# EAGLE design prop_breakout (EAGLE 7.5.0)
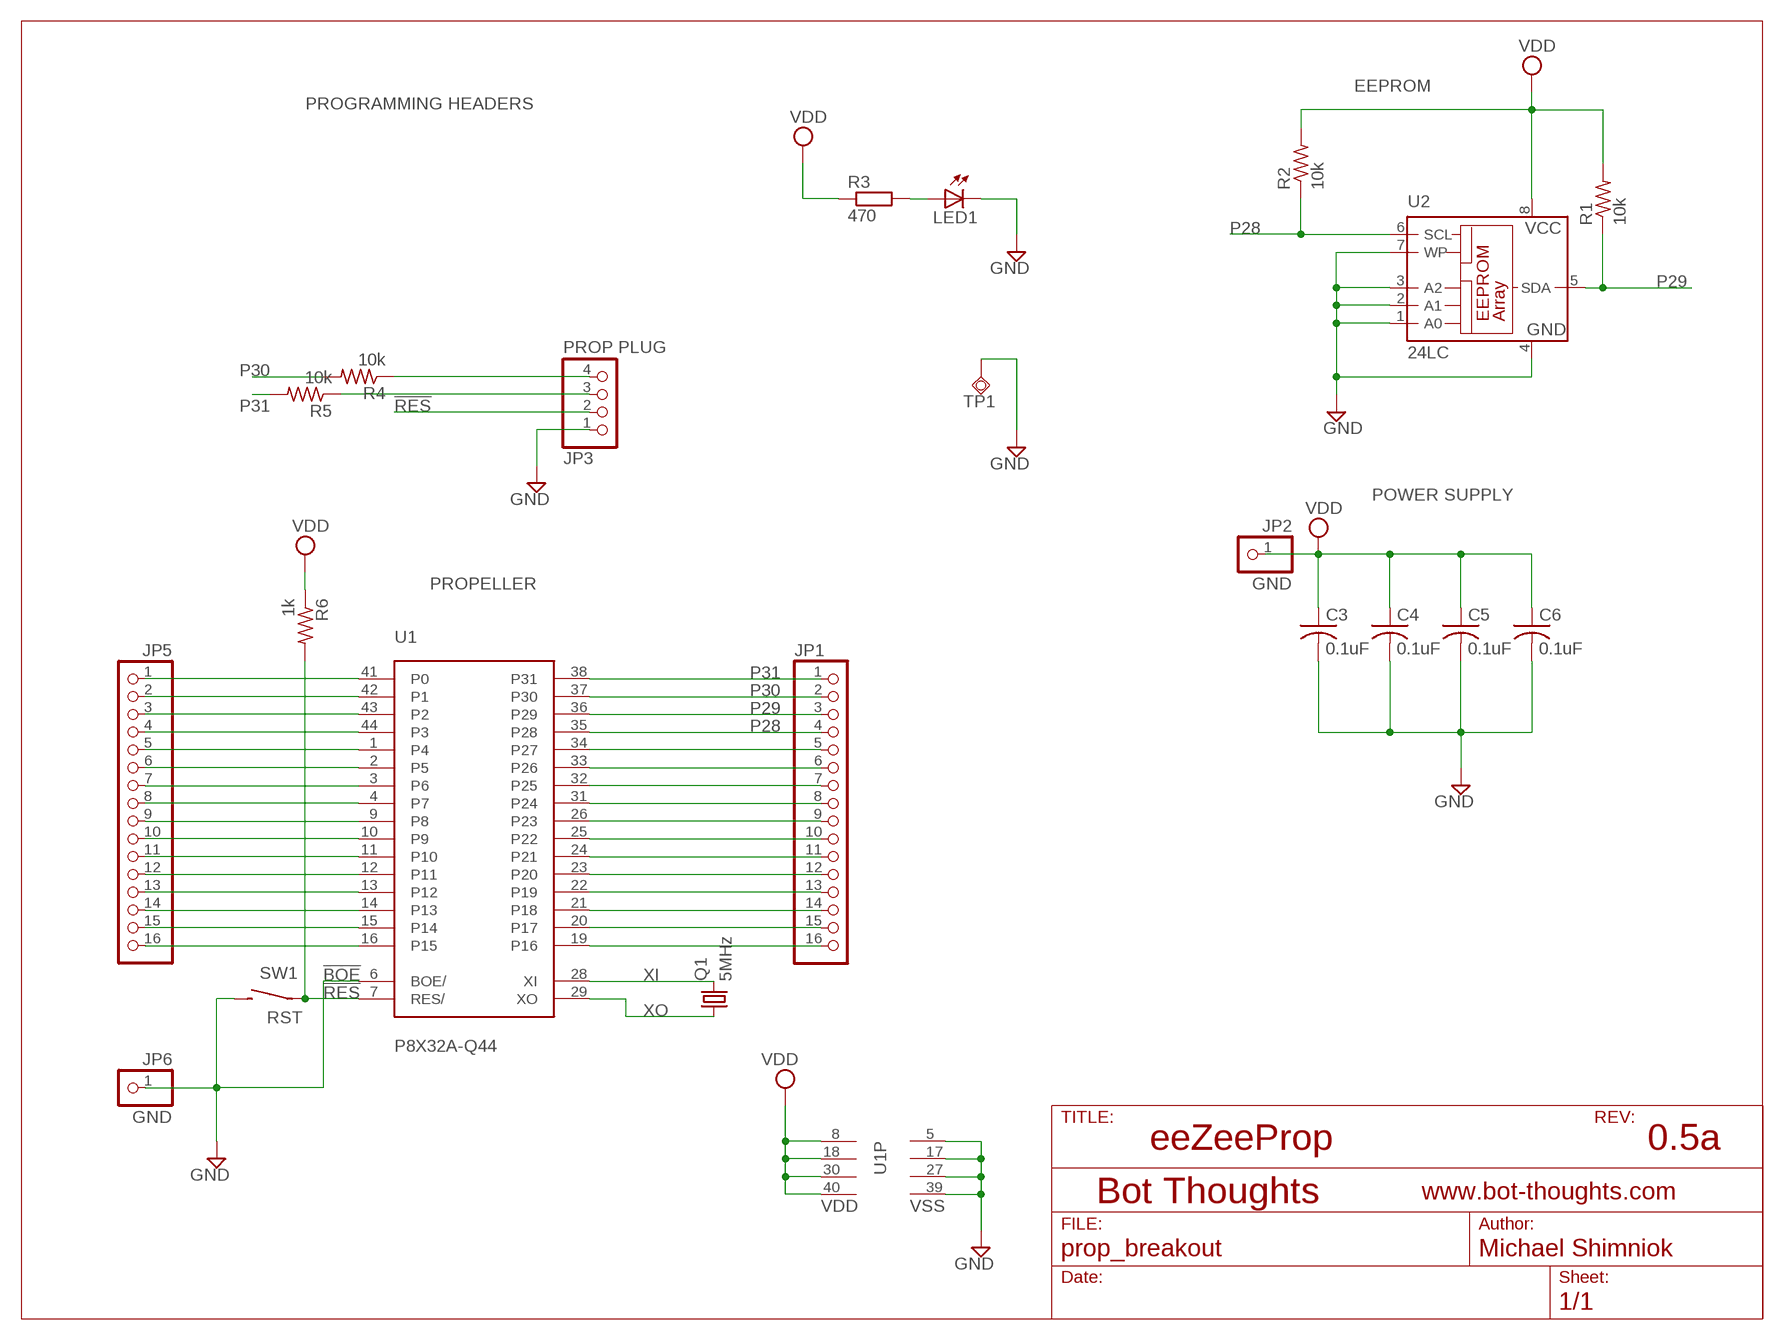
[diagram p0: schematic, sheet 1]

## Parts
C3  0.1uF  C-USC0805  [C0805]
C4  0.1uF  C-USC0805  [C0805]
C5  0.1uF  C-USC0805  [C0805]
C6  0.1uF  C-USC0805  [C0805]
JP1  PINHD-1X16_2.54-S  [1X16-S]
JP2  GND  PINHD-1X01_2.54  [1X01]
JP3  PROP PLUG  PINHD-1X04_2.54-S  [1X04-S]
JP5  PINHD-1X16_2.54-S  [1X16-S]
JP6  GND  PINHD-1X01_2.54  [1X01]
LED1  0  LEDCHIPLED_1206  [CHIPLED_1206]
Q1  5MHz  CRYSTALHC49U-V  [HC49U-V]
R1  10k  R-US_R0805  [R0805]
R2  10k  R-US_R0805  [R0805]
R3  470  R-EU_R0805  [R0805]
R4  10k  R-US_R0805  [R0805]
R5  10k  R-US_R0805  [R0805]
R6  1k  R-US_R0805  [R0805]
SW1  RST  SPST_TAC_RECT1  [6MMTACTILE_RECT]
TP1  TPSQTP20R  [TP20R]
U1  P8X32A-Q44  [P8X32A-Q44]
U2  24LC  24LC128SN  [SO-08]

## Nets
!RES: JP3.2 R6.2 SW1.P$1(P) U1.7(RES/)
GND [GND]: C3.2 C4.2 C5.2 C6.2 JP3.1 JP6.1 LED1.C SW1.P$2(S) TP1.TP U1.5(VSS) U1.6(BOE/) U1.17(VSS) U1.27(VSS) U1.39(VSS) U2.1(A0) U2.2(A1) U2.3(A2) U2.4(GND) U2.7(WP)
N$1: JP5.1 U1.41(P0)
N$2: JP5.2 U1.42(P1)
N$3: JP5.3 U1.43(P2)
N$4: JP5.4 U1.44(P3)
N$5: LED1.A R3.2
N$6: JP5.5 U1.1(P4)
N$8: JP5.6 U1.2(P5)
N$9: JP5.7 U1.3(P6)
N$10: JP5.8 U1.4(P7)
N$11: JP5.9 U1.9(P8)
N$12: JP5.10 U1.10(P9)
N$13: JP5.11 U1.11(P10)
N$14: JP5.12 U1.12(P11)
N$15: JP5.13 U1.13(P12)
N$16: JP5.14 U1.14(P13)
N$17: JP5.15 U1.15(P14)
N$18: JP5.16 U1.16(P15)
N$19: JP1.5 U1.34(P27)
N$20: JP1.6 U1.33(P26)
N$21: JP1.7 U1.32(P25)
N$22: JP1.8 U1.31(P24)
N$23: JP1.9 U1.26(P23)
N$24: JP1.10 U1.25(P22)
N$25: JP1.11 U1.24(P21)
N$26: JP1.12 U1.23(P20)
N$27: JP1.13 U1.22(P19)
N$28: JP1.14 U1.21(P18)
N$29: JP1.15 U1.20(P17)
N$30: JP1.16 U1.19(P16)
P28: JP1.4 R2.1 U1.35(P28) U2.6(SCL)
P29: JP1.3 R1.1 U1.36(P29) U2.5(SDA)
P30: JP1.2 R4.2 U1.37(P30)
P31: JP1.1 R5.2 U1.38(P31)
RXI: JP3.4 R4.1
TXO: JP3.3 R5.1
VDD [VCC]: C3.1 C4.1 C5.1 C6.1 JP2.1 R1.2 R2.2 R3.1 R6.1 U1.8(VDD) U1.18(VDD) U1.30(VDD) U1.40(VDD) U2.8(VCC)
XI: Q1.2 U1.28(XI)
XO: Q1.1 U1.29(XO)

## Notes on the sheet
- EEPROM
- PROGRAMMING HEADERS
- POWER SUPPLY
- PROPELLER
- !BOE
- eeZeeProp | 0.5a

## Library data of the parts
C3-C6 = rcl:C-US: CAPACITOR, American symbol; PARTNO: 0603YC104KAT2A; SIZE: (0603); TC: X5R; TOL: 20%; TYPE: CER; VOLT: 10V
JP1 JP5 = pinhead-2:PINHD-1X16: PIN HEADER
JP2 JP6 = pinhead-2:PINHD-1X01: PIN HEADER
JP3 = pinhead-2:PINHD-1X04: PIN HEADER
LED1 = led:LED: LED OSRAM: - CHIPLED LG R971, LG N971, LY N971, LG Q971, LY Q971, LO R971, LY R971 LH N974, LH R974 LS Q976, LO Q976, LY Q976 LO Q996 - Hyper CHIPLED LW Q18S LB Q993, LB Q99A, LB R99A - SideLED LS A670, LO A670, LY A670, LG A670, LP A670 LB A673, LV A673, LT A673, LW A673 LH A674 LY A675 LS A676, LA A676, LO A676, LY A676, LW A676 LS A679, LY A679, LG A679 - Hyper Micro SIDELED® LS Y876, LA Y876, LO Y876, LY Y876 LT Y87S - SmartLED LW L88C, LW L88S LB L89C, LB L89S, LG L890 LS L89K, LO L89K, LY L89K LS L896, LA L896, LO L896, LY L896 - TOPLED LS T670, LO T670, LY T670, LG T670, LP T670 LSG T670, LSP T670, LSY T670, LOP T670, LYG T670 LG T671, LOG T671, LSG T671 LB T673, LV T673, LT T673, LW T673 LH T674 LS T676, LA T676, LO T676, LY T676, LB T676, LH T676, LSB T676, LW T676 LB T67C, LV T67C, LT T67C, LS T67K, LO T67K, LY T67K, LW E67C LS E67B, LA E67B, LO E67B, LY E67B, LB E67C, LV E67C, LT E67C LW T67C LS T679, LY T679, LG T679 LS T770, LO T770, LY T770, LG T770, LP T770 LB T773, LV T773, LT T773, LW T773 LH T774 LS E675, LA E675, LY E675, LS T675 LS T776, LA T776, LO T776, LY T776, LB T776 LHGB T686 LT T68C, LB T68C - Hyper Mini TOPLED® LB M676 - Mini TOPLED Santana® LG M470 LS M47K, LO M47K, LY M47K Source: http://www.osram.convergy.de LUXEON: - LUMILED® LXK2-PW12-R00, LXK2-PW12-S00, LXK2-PW14-U00, LXK2-PW14-V00 LXK2-PM12-R00, LXK2-PM12-S00, LXK2-PM14-U00 LXK2-PE12-Q00, LXK2-PE12-R00, LXK2-PE12-S00, LXK2-PE14-T00, LXK2-PE14-U00 LXK2-PB12-K00, LXK2-PB12-L00, LXK2-PB12-M00, LXK2-PB14-N00, LXK2-PB14-P00, LXK2-PB14-Q00 LXK2-PR12-L00, LXK2-PR12-M00, LXK2-PR14-Q00, LXK2-PR14-R00 LXK2-PD12-Q00, LXK2-PD12-R00, LXK2-PD12-S00 LXK2-PH12-R00, LXK2-PH12-S00 LXK2-PL12-P00, LXK2-PL12-Q00, LXK2-PL12-R00 Source: www.luxeon.com KINGBRIGHT: KA-3528ASYC Source: www.kingbright.com
Q1 = crystal:CRYSTAL: CRYSTAL; OC_FARNELL: 1666969; OC_NEWARK: unknown; PARTNO: HC49US-5.000MABJ-UB
R1 R2 = rcl:R-US_: RESISTOR, American symbol; PARTNO: ERJ-3GEYJ103V; RATE: 100mW; SIZE: (0603); TOL: 5%
R3 = resistor:R-EU_: RESISTOR, European symbol
R4-R6 = rcl:R-US_: RESISTOR, American symbol; PARTNO: RC0603JR-071KL; RATE: 100mW; SIZE: (0603); TOL: 5%
SW1 = mes_electromech:SPST: SPST SWITCH; PARTNO: MJTP1243
TP1 = testpad:TPSQ: Test pad
U1 = parallax_propeller:P8X32A-Q44; PARTNO: P8X32A-Q44
U2 = microchip:24*: Serial EEPROM I2C; MF: OnSemi; MPN: CAT24C256WI-GT3; OC_FARNELL: 9757937; OC_NEWARK: 30H1511; PARTNO: CAT24C256WI-GT3

## Net classes
0 default: width 0.203 mm
1 VCC: width 0.508 mm, drill 0.508 mm
2 GND: width 0.508 mm, drill 0.508 mm

## Board
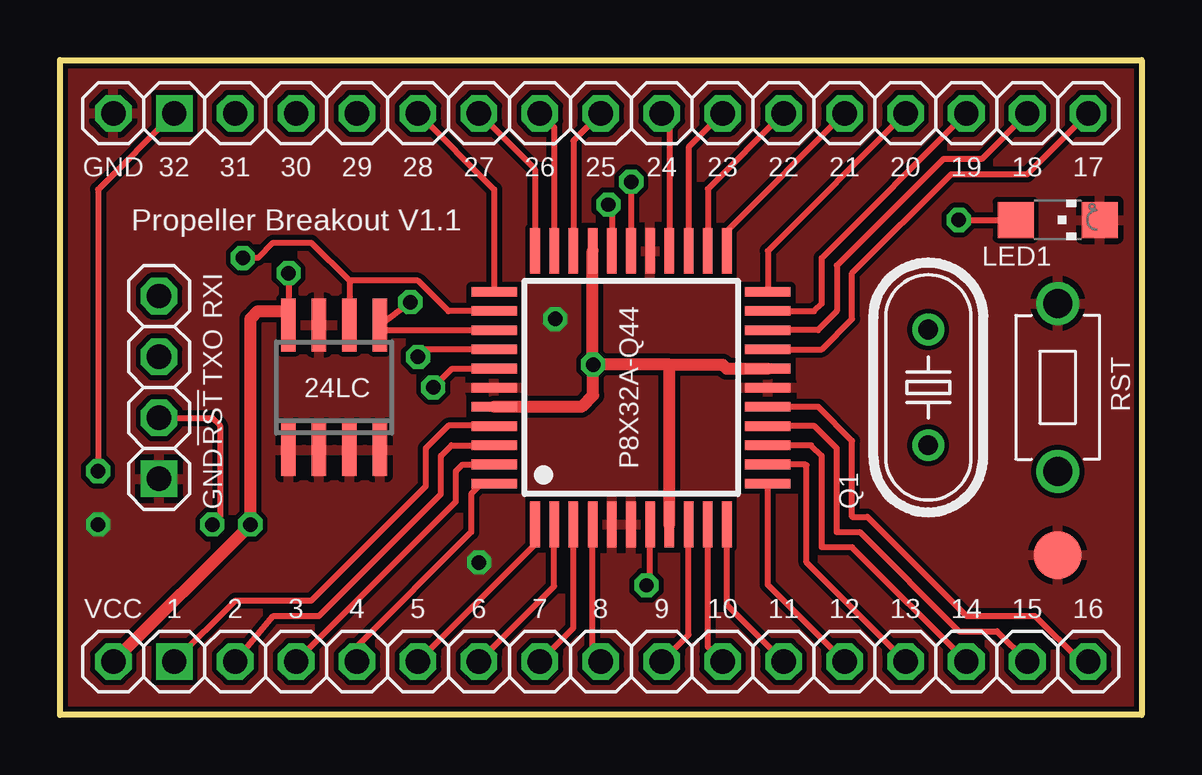
[diagram p1: board, top side]
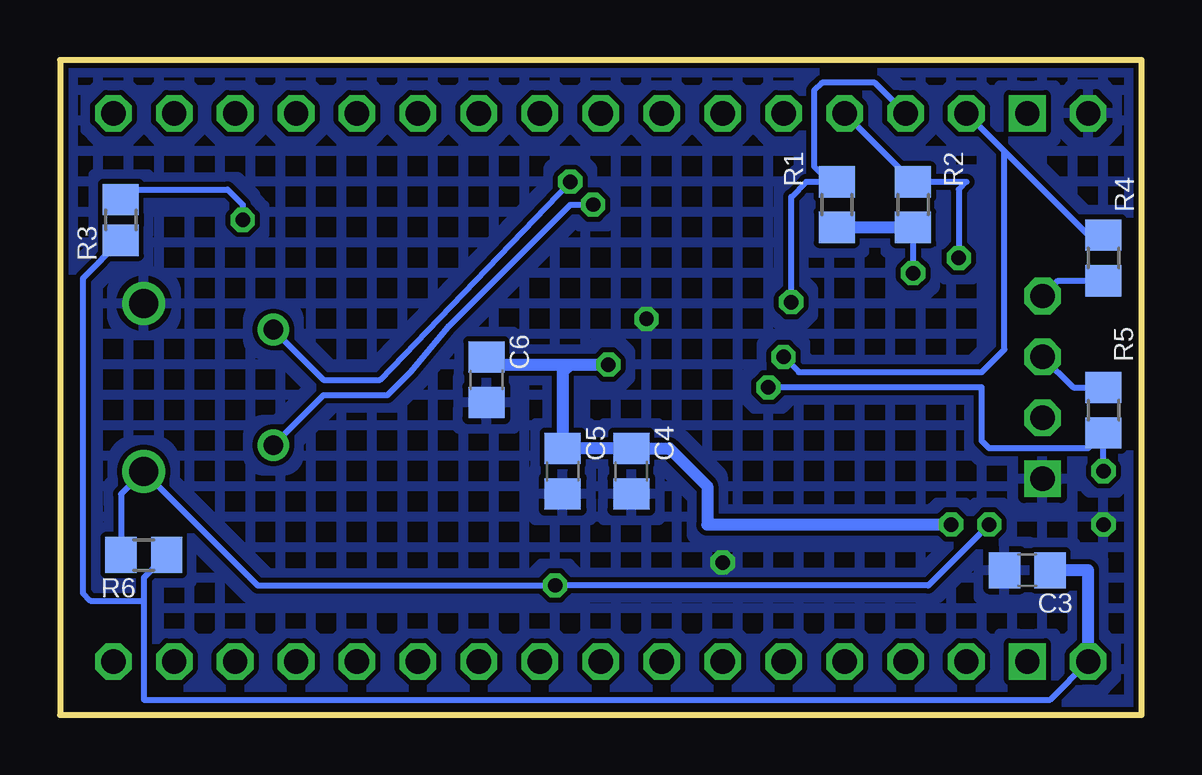
[diagram p2: board, bottom side, seen from below]

Size 45.09 x 27.3 mm. Coordinates in mm from the lower left corner, seen from the top.
Outline: 0,0 0,27.3 45.09,27.3 45.09,0 0,0
Copper layers (1*16): Top 0.035mm / dielectric 1.5mm / Bottom 0.035mm
Design rules "default *": minimum track width 10mil, minimum drill 20mil, track to track 8mil, track to pad 8mil, pad to pad 8mil, via to via 8mil, smd to smd 8mil, copper to edge 8mil, drill to drill 8mil, minimum pad ring 10mil, minimum via ring 8mil, stop-mask expansion 4mil, vias tented up to drill 0mil, thermal gap 10mil

### Footprints (pad centres in the part's own frame; a part is rotated, then mirrored left to right if it is on the bottom)
C0805 = smd 1.3 x 1.5: 1 -0.95,0; 2 0.95,0
1X16-S = drill 1.016 square: 1 -19.05,0 | drill 1.016 octagon: 2 -16.51,0; 3 -13.97,0; 4 -11.43,0; 5 -8.89,0; 6 -6.35,0; 7 -3.81,0; 8 -1.27,0; 9 1.27,0; 10 3.81,0; 11 6.35,0; 12 8.89,0; 13 11.43,0; 14 13.97,0; 15 16.51,0; 16 19.05,0
1X01 = drill 1.016 octagon: 1 0,0
1X04-S = drill 1.016 square: 1 -3.81,0 | drill 1.016 octagon: 2 -1.27,0; 3 1.27,0; 4 3.81,0
CHIPLED_1206 = smd 1.5 x 1.5: A 0,-1.75; C 0,1.75
HC49U-V = drill 0.813: 1 -2.413,0; 2 2.413,0
R0805 = smd 1.3 x 1.5: 1 -0.95,0; 2 0.95,0
R0805' = smd 1.3 x 1.5: 1 -0.85,0; 2 0.85,0
6MMTACTILE_RECT = drill 1.2: P$1 -3.5,0; P$2 3.5,0
TP20R = smd 2 x 2: TP 0,0
P8X32A-Q44 = smd 1.9 x 0.4: 1 -5.713,4.013; 2 -5.713,3.212; 3 -5.713,2.413; 4 -5.713,1.613; 5 -5.713,0.812; 6 -5.713,0.013; 7 -5.713,-0.787; 8 -5.713,-1.587; 9 -5.713,-2.388; 10 -5.713,-3.188; 11 -5.713,-3.987; 23 5.688,-3.987; 24 5.688,-3.188; 25 5.688,-2.388; 26 5.688,-1.587; 27 5.688,-0.787; 28 5.688,0.013; 29 5.688,0.812; 30 5.688,1.613; 31 5.688,2.413; 32 5.688,3.212; 33 5.688,4.013 | smd 0.4 x 1.9: 12 -4.013,-5.688; 13 -3.212,-5.688; 14 -2.413,-5.688; 15 -1.613,-5.688; 16 -0.812,-5.688; 17 -0.013,-5.688; 18 0.787,-5.688; 19 1.587,-5.688; 20 2.388,-5.688; 21 3.188,-5.688; 22 3.987,-5.688; 34 3.987,5.713; 35 3.188,5.713; 36 2.388,5.713; 37 1.587,5.713; 38 0.787,5.713; 39 -0.013,5.713; 40 -0.812,5.713; 41 -1.613,5.713; 42 -2.413,5.713; 43 -3.212,5.713; 44 -4.013,5.713
SO-08 = smd 0.6 x 2.2: 1 -1.905,-2.6; 2 -0.635,-2.6; 3 0.635,-2.6; 4 1.905,-2.6; 5 1.905,2.6; 6 0.635,2.6; 7 -0.635,2.6; 8 -1.905,2.6

### Placement (x,y rotation side)
C3  4.76,6.03 180 bottom
C4  21.27,10.16 270 bottom
C5  24.13,10.16 270 bottom
C6  27.31,13.97 270 bottom
JP1  23.81,25.08 0 top
JP2  2.22,2.22 0 top
JP3  4.13,13.65 90 top
JP5  23.81,2.22 0 top
JP6  2.22,25.08 0 top
LED1  41.59,20.64 270 top
Q1  36.2,13.65 90 top
R1  12.7,21.27 270 bottom
R2  9.53,21.27 270 bottom
R3  470  [R0805']  42.55,20.64 90 bottom
R4  1.59,19.05 90 bottom
R5  1.59,12.7 270 bottom
R6  41.59,6.67 180 bottom
SW1  41.59,13.65 90 top
TP1  41.59,6.67 0 top
U1  23.81,13.65 90 top
U2  11.43,13.65 0 top

### Tracks (layer width: path | path; a pad name or v marks a point on that pad's centre or on a via)
!RES  (via drill 0.6)
  Top 0.254: v24.45,5.4 24.6,5.55 U1.7 | JP3.2 6.35,12.38 6.67,12.06 6.67,8.25 v6.35,7.94
  Bottom 0.254: R6.2 42.54,9.2 SW1.P$1 36.84,5.4 v24.45,5.4 8.89,5.4 v6.35,7.94
GND  (via drill 0.6)
  other vias: 17.46,6.35 20.64,16.51 1.59,7.94
  pour Bottom (hatched): -0.95,28.26 46.36,28.26 46.36,-1.27 -0.95,-1.27
  pour Top: -0.95,28.26 46.36,28.26 46.36,-1.27 -0.95,-1.27
N$1
  Top 0.254: U1.41 18.07,12.06 16.19,12.06 15.24,11.11 15.24,9.52 10.48,4.76 7.3,4.76 JP5.1
N$2
  Top 0.254: JP5.2 8.89,4.13 10.79,4.13 15.87,9.21 15.87,10.8 16.32,11.24 U1.42
N$3
  Top 0.254: JP5.3 16.51,8.89 16.51,10.16 16.79,10.44 U1.43
N$4
  Top 0.254: JP5.4 12.38,2.86 17.14,7.62 17.14,9.21 17.58,9.64 U1.44
N$5  (via drill 0.6)
  Top 0.254: v37.47,20.64 LED1.A
  Bottom 0.254: R3.2 42.12,21.91 38.1,21.91 37.47,21.27 v37.47,20.64
N$6
  Top 0.254: JP5.5 19.8,7.1 U1.1
N$8
  Top 0.254: JP5.6 20.6,5.36 U1.2
N$9
  Top 0.254: JP5.7 21.4,3.62 U1.3
N$10
  Top 0.254: JP5.8 22.2,2.56 U1.4
N$11
  Top 0.254: JP5.9 26.2,3.34 U1.9
N$12
  Top 0.254: JP5.10 27,2.84 U1.10
N$13
  Top 0.254: JP5.11 27.8,4.58 U1.11
N$14
  Top 0.254: JP5.12 29.5,5.42 U1.12
N$15
  Top 0.254: JP5.13 31.12,6.35 31.12,10.4 31.08,10.44 U1.13
N$16
  Top 0.254: JP5.14 33.02,6.98 31.75,6.98 31.75,10.8 31.31,11.24 U1.14
N$17
  Top 0.254: U1.15 31.46,12.04 32.39,11.11 32.39,7.62 33.34,7.62 37.47,3.49 39.05,3.49 JP5.15
N$18
  Top 0.254: U1.16 31.61,12.84 33.02,11.43 33.02,8.25 33.65,8.25 37.78,4.13 40.64,4.13 42.54,2.22 JP5.16
N$19
  Top 0.254: JP1.5 18.1,21.91 U1.34
N$20
  Top 0.254: JP1.6 19.8,22.74 U1.33
N$21
  Top 0.254: JP1.7 20.6,24.48 U1.32
N$22
  Top 0.254: JP1.8 21.4,23.94 U1.31
N$23
  Top 0.254: JP1.9 25.4,24.77 U1.26
N$24
  Top 0.254: JP1.10 26.2,23.66 U1.25
N$25
  Top 0.254: JP1.11 27,21.92 U1.24
N$26
  Top 0.254: JP1.12 27.8,20.18 U1.23
N$27
  Top 0.254: JP1.13 29.5,19.34 U1.22
N$28
  Top 0.254: U1.21 29.51,16.83 31.43,16.83 31.75,17.14 31.75,19.05 JP1.14
N$29
  Top 0.254: JP1.15 38.42,23.18 36.83,23.18 32.39,18.73 32.39,16.83 31.6,16.04 U1.20
N$30
  Top 0.254: U1.19 31.75,15.24 33.02,16.51 33.02,18.41 37.15,22.54 40.32,22.54 JP1.16
P28  (via drill 0.6)
  Top 0.254: U1.35 18.09,16.83 16.19,16.83 14.92,18.1 12.07,18.1 | 12.07,18.1 U2.6 | 12.07,18.1 10.48,19.69 8.89,19.69 8.25,19.05 v7.62,19.05
  Bottom 0.254: JP1.4 R2.1 | R2.1 | R2.1 7.3,22.22 7.62,21.91 v7.62,19.05
P29  (via drill 0.6)
  Top 0.254: U1.36 13.55,16.04 U2.5 v14.61,17.2
  Bottom 0.254: JP1.3 11.11,26.35 13.33,26.35 13.65,26.03 13.65,22.86 13.01,22.22 R1.1 13.97,22.22 14.61,21.59 v14.61,17.2
P30  (via drill 0.6)
  Top 0.254: U1.37 15.24,15.24 v14.92,14.92
  Bottom 0.254: JP1.2 5.72,23.49 | 5.72,23.49 2.22,20 R4.2 | v14.92,14.92 14.29,14.29 6.67,14.29 5.72,15.24 5.72,23.49
P31  (via drill 0.6)
  Top 0.254: JP1.1 1.59,21.91 v1.59,10.16 | v15.56,13.65 16.35,14.44 U1.38
  Bottom 0.254: v1.59,10.16 R5.2 2.22,11.11 6.35,11.11 6.67,11.43 6.67,13.65 v15.56,13.65
RXI
  Bottom 0.254: JP3.4 3.49,18.1 R4.1
TXO
  Bottom 0.254: JP3.3 2.86,13.65 R5.1
VDD  (via drill 0.6)
  Top 0.254: v9.53,18.41 U2.8
  Top 0.508: JP2.1 v7.94,7.94 | v7.94,7.94 7.94,8.25 | v7.94,7.94 7.94,16.51 8.25,16.83 9.53,16.83 U2.8 | v22.22,14.6 22.2,14.63 U1.30 | v22.22,14.6 22.22,13.33 21.73,12.84 U1.40 | U1.8 25.4,14.6 | 25.4,14.6 v22.22,14.6 | 25.4,14.6 27.62,14.6 27.79,14.44 U1.18
  Bottom 0.254: R2.2 v9.53,18.41 | R6.1 41.59,5.72 41.59,4.76 | 41.59,4.76 41.59,0.63 3.81,0.63 JP2.1 | R3.1 44.13,18.2 44.13,5.08 43.81,4.76 41.59,4.76
  Bottom 0.508: JP2.1 2.22,6.03 C3.1 | R2.2 R1.2 | v7.94,7.94 18.1,7.94 18.1,9.53 19.68,11.11 C4.1 C5.1 24.13,14.29 23.81,14.6 | C6.1 26.99,14.6 23.81,14.6 | 23.81,14.6 v22.22,14.6
XI  (via drill 0.6)
  Top 0.254: v23.81,22.22 23.8,21.89 U1.28
  Bottom 0.254: Q1.2 34.1,13.97 31.75,13.97 v23.81,22.22
XO  (via drill 0.6)
  Top 0.254: v22.86,21.27 23,20.81 U1.29
  Bottom 0.254: Q1.1 34.1,13.33 31.43,13.33 30.48,14.29 28.89,16.19 23.81,21.27 v22.86,21.27

### Text on the board
tNames: GND | 32 | 31 | 30 | 29 | 28 | 27 | 26 | 25 | 24 | 23 | 22 | 21 | 20 | 19 | 18 | 17 | Propeller Breakout V1.1 | RXI | TXO | !RST | GND | VCC | 1 | 2 | 3 | 4 | 5 | 6 | 7 | 8 | 9 | 10 | 11 | 12 | 13 | 14 | 15 | 16